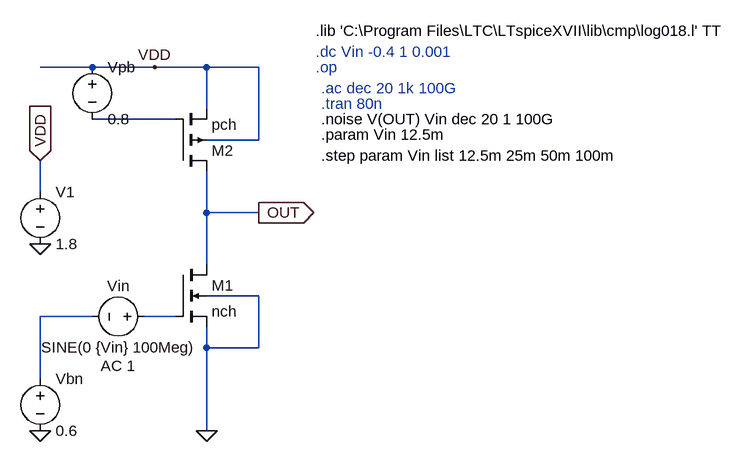
[diagram p0: schematic Draft1.asc]
Draft1.asc, the LTspice schematic file:
Version 4
SHEET 1 1076 680
WIRE -272 32 -352 32
WIRE -176 32 -272 32
WIRE -96 32 -176 32
WIRE -16 32 -96 32
WIRE -96 96 -96 32
WIRE -144 112 -272 112
WIRE -16 144 -16 32
WIRE -16 144 -96 144
WIRE -352 224 -352 176
WIRE -96 256 -96 192
WIRE -16 256 -96 256
WIRE -96 336 -96 256
WIRE -16 384 -96 384
WIRE -272 416 -352 416
WIRE -144 416 -192 416
WIRE -96 464 -96 432
WIRE -16 464 -16 384
WIRE -16 464 -96 464
WIRE -352 512 -352 416
WIRE -96 592 -96 464
FLAG -352 592 0
FLAG -96 592 0
FLAG -352 304 0
FLAG -16 256 OUT
IOPIN -16 256 Out
FLAG -352 176 VDD
IOPIN -352 176 In
FLAG -176 32 VDD
DATAFLAG -96 256 ""
SYMBOL nmos4 -144 336 R0
SYMATTR InstName M1
SYMATTR Value nch
SYMATTR Value2 l=180n w=10u m=2
SYMBOL pmos4 -144 192 M180
SYMATTR InstName M2
SYMATTR Value pch
SYMATTR Value2 l=180n w=10u m=2
SYMBOL voltage -176 416 R90
WINDOW 0 -32 56 VBottom 2
WINDOW 3 32 56 VTop 2
WINDOW 123 60 56 VTop 2
WINDOW 39 0 0 Left 0
SYMATTR InstName Vin
SYMATTR Value SINE(0 {Vin} 100Meg)
SYMATTR Value2 AC 1
SYMBOL voltage -352 496 R0
WINDOW 123 0 0 Left 0
WINDOW 39 0 0 Left 0
SYMATTR InstName Vbn
SYMATTR Value 0.6
SYMBOL voltage -352 208 R0
SYMATTR InstName V1
SYMATTR Value 1.8
SYMBOL voltage -272 16 R0
SYMATTR InstName Vpb
SYMATTR Value 0.8
TEXT 72 -24 Left 2 !.lib 'C:\\Program Files\\LTC\\LTspiceXVII\\lib\\cmp\\log018.l' TT
TEXT 72 8 Left 2 ;.dc Vin -0.4 1 0.001
TEXT 72 32 Left 2 ;.op
TEXT 80 64 Left 2 ;.ac dec 20 1k 100G
TEXT 80 88 Left 2 ;.tran 80n
TEXT 80 112 Left 2 !.noise V(OUT) Vin dec 20 1 100G
TEXT 80 136 Left 2 !.param Vin 12.5m
TEXT 80 168 Left 2 !.step param Vin list 12.5m 25m 50m 100m

The netlist it stands for:
* Draft1.asc
M1 OUT N003 0 0 nch l=180n w=10u m=2
M2 OUT N001 VDD VDD pch l=180n w=10u m=2
Vin N003 N002 SINE(0 {Vin} 100Meg) AC 1
Vbn N002 0 0.6
V1 VDD 0 1.8
Vpb VDD N001 0.8
.model NMOS NMOS
.model PMOS PMOS
.lib standard.mos
.lib 'C:\Program Files\LTC\LTspiceXVII\lib\cmp\log018.l' TT
* .dc Vin -0.4 1 0.001
* .op
* .ac dec 20 1k 100G
* .tran 80n
.noise V(OUT) Vin dec 20 1 100G
.param Vin 12.5m
.step param Vin list 12.5m 25m 50m 100m
.backanno
.end